# Altium schematic sheet RELAY.SchDoc
size A; SheetNumber: 5; SheetTotal: 6
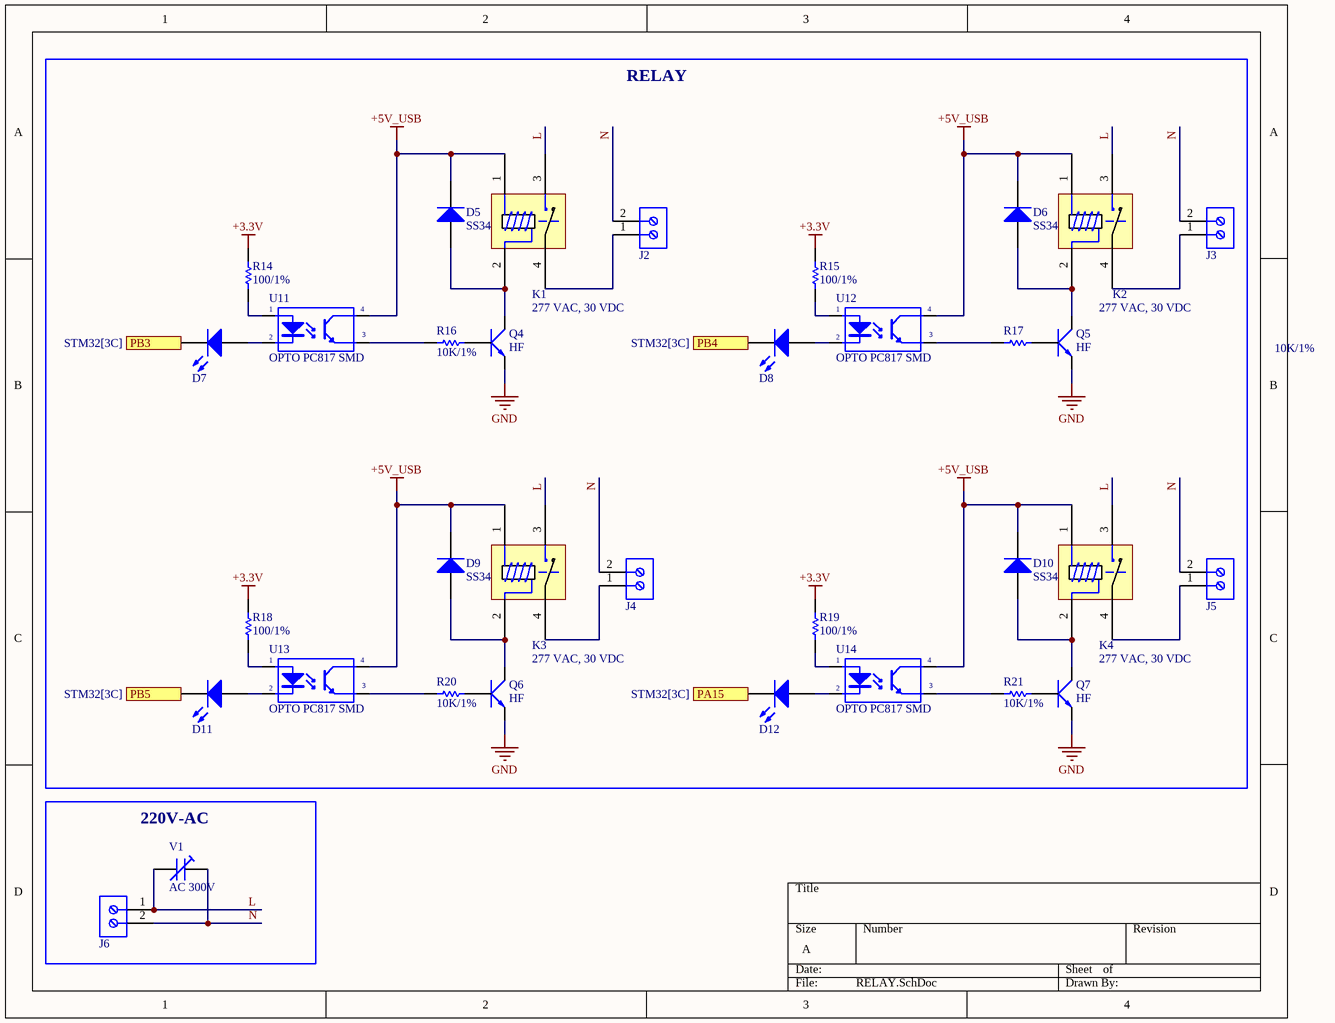
[diagram p0: RELAY.SchDoc]

## Parts
D5  SS34  [DIODE SMA]
D6  SS34  [DIODE SMA]
D7  LED SMD  [LED_0805_Blue]  (value not drawn)
D8  LED SMD  [LED_0805_Blue]  (value not drawn)
D9  SS34  [DIODE SMA]
D10  SS34  [DIODE SMA]
D11  LED SMD  [LED_0805_Blue]  (value not drawn)
D12  LED SMD  [LED_0805_Blue]  (value not drawn)
J2  10A, 300V  [691214110002]  (value not drawn)
J3  10A, 300V  [691214110002]  (value not drawn)
J4  10A, 300V  [691214110002]  (value not drawn)
J5  10A, 300V  [691214110002]  (value not drawn)
J6  10A, 300V  [691214110002]  (value not drawn)
K1  277 VAC, 30 VDC  [HF46F]
K2  277 VAC, 30 VDC  [HF46F]
K3  277 VAC, 30 VDC  [HF46F]
K4  277 VAC, 30 VDC  [HF46F]
Q4  HF  [SOT-23]
Q5  HF  [SOT-23]
Q6  HF  [SOT-23]
Q7  HF  [SOT-23]
R14  value 100/1%  [RES-SM-0805]  (hidden comment: RESISTOR SMD)
R15  value 100/1%  [RES-SM-0805]  (hidden comment: RESISTOR SMD)
R16  value 10K/1%  [RES-SM-0805]  (hidden comment: RESISTOR SMD)
R17  value 10K/1%  [RES-SM-0805]  (hidden comment: RESISTOR SMD)
R18  value 100/1%  [RES-SM-0805]  (hidden comment: RESISTOR SMD)
R19  value 100/1%  [RES-SM-0805]  (hidden comment: RESISTOR SMD)
R20  value 10K/1%  [RES-SM-0805]  (hidden comment: RESISTOR SMD)
R21  value 10K/1%  [RES-SM-0805]  (hidden comment: RESISTOR SMD)
U11  OPTO PC817 SMD  [SOP4]
U12  OPTO PC817 SMD  [SOP4]
U13  OPTO PC817 SMD  [SOP4]
U14  OPTO PC817 SMD  [SOP4]
V1  AC 300V  [Varistor]

## Blocks framed on the sheet
RELAY: D5-D12 J2-J5 K1-K4 Q4-Q7 R14-R21 U11-U14
220V-AC: J6 V1

## Ports
PA15 (in, see STM32[3C]), PB3 (in, see STM32[3C]), PB4 (in, see STM32[3C]), PB5 (in, see STM32[3C])

## Nets
+3.3V: R14.2 R15.2 R18.2 R19.2
+5V_USB: D5.2(K) D6.2(K) D9.2(K) D10.2(K) K1.1(Coil) K2.1(Coil) K3.1(Coil) K4.1(Coil) U11.4(C) U12.4(C) U13.4(C) U14.4(C)
GND: Q4.2(E) Q5.2(E) Q6.2(E) Q7.2(E)
L: J6.1 K1.3(NO) K2.3(NO) K3.3(NO) K4.3(NO) V1.1
N: J2.2 J3.2 J4.2 J5.2 J6.2 V1.2
PA15: D12.2(K) ; port PA15
PB3: D7.2(K) ; port PB3
PB4: D8.2(K) ; port PB4
PB5: D11.2(K) ; port PB5
NetD5_1: D5.1(A) K1.2(Coil) Q4.3(C)
NetD6_1: D6.1(A) K2.2(Coil) Q5.3(C)
NetD7_1: D7.1(A) U11.2(K)
NetD8_1: D8.1(A) U12.2(K)
NetD9_1: D9.1(A) K3.2(Coil) Q6.3(C)
NetD10_1: D10.1(A) K4.2(Coil) Q7.3(C)
NetD11_1: D11.1(A) U13.2(K)
NetD12_1: D12.1(A) U14.2(K)
NetJ2_1: J2.1 K1.4
NetJ3_1: J3.1 K2.4
NetJ4_1: J4.1 K3.4
NetJ5_1: J5.1 K4.4
NetQ4_1: Q4.1(B) R16.1
NetQ5_1: Q5.1(B) R17.1
NetQ6_1: Q6.1(B) R20.1
NetQ7_1: Q7.1(B) R21.1
NetR14_1: R14.1 U11.1(A)
NetR15_1: R15.1 U12.1(A)
NetR16_2: R16.2 U11.3(E)
NetR17_2: R17.2 U12.3(E)
NetR18_1: R18.1 U13.1(A)
NetR19_1: R19.1 U14.1(A)
NetR20_2: R20.2 U13.3(E)
NetR21_2: R21.2 U14.3(E)

## Library data of the parts
D5 D6 D9 D10 = Diode SS34 ( 1N5822 ): Dán; Don_Vi: Con; Ma_Hang: MH002104; Ten_Linh_Kien: Diode SS34 3A 40V SMA ( 1N5822 SS34A); Kieu_Chan: *; Chung_Loai: Dán
D7 D8 D11 D12 = LED SMD: LED
J2-J6 = 691214110002: WR-TBL Series 2141 Horizontal Entry Modular, THT, pitch 3.5mm, 2p; Manufacturer: Wurth Elektronik; Modularity: Yes; ComponentLink1Description: Website Link; ComponentLink1URL: https://www.we-online.com/redexpert/article/691214110002?ad; ComponentLink2Description: Supplier 1 URL; ComponentLink2URL: N/A; Manufacturer Part Number: 691214110002; Category: Terminal Blocks; Match Code: WR-TBL; Mount: Through Hole; Operating Temperature Max: 105°C; Operating Temperature Min: -40°C; Packaging: Box; Application: Rising Cage Clamp; Number of Pins: 2; Number of Rows: 1; Orientation: Horizontal; Pitch: 3.5mm; Rated Current: 10A; Working Voltage: 300V; ComponentLink3Description: Supplier 2 URL; ComponentLink3URL: N/A; ComponentLink4Description: Supplier 3 URL; ComponentLink4URL: https://www.thegioiic.com/kf350-2-v-domino-2-chan-thang-3-5mm-300v-10a-han-pcb; Supplier 1 Name: Mouser; Supplier 1 SN: N/A; Supplier 1 URL: N/A; Supplier 2 Name: Digi-Key; Supplier 2 SN: N/A; Supplier 2 URL: N/A; Supplier 3 Name: thegioiic; Supplier 3 SN: N/A; Supplier 3 URL: https://www.thegioiic.com/kf350-2-v-domino-2-chan-thang-3-5mm-300v-10a-han-pcb; Value: 10A, 300V
K1-K4 = HF46F-G 12-HS1: Coil Voltage: 12 VDC; Contact Current Rating: 7A; Switching Voltage Max: 277 VAC, 30 VDC; Coil Voltage: 12 VDC; Associated Relay Series: N/A; Coil Current: N/A; Coil Resistance: N/A; ComponentLink1Description: Datasheet link; ComponentLink1URL: https://source.hongfa.com//pdf/web/viewer.html?file=/Uploads/Product/PDF/HF46F-G_en.pdf?timestamp=1691116874; ComponentLink2Description: Supplier 1 URL; ComponentLink2URL: N/A; ComponentLink3Description: Supplier 2 URL; ComponentLink3URL: N/A; ComponentLink4Description: Supplier 3 URL; ComponentLink4URL: https://www.thegioiic.com/hf46f-g-12-hs1-ro-le-12vdc-7a-spst-no-4-chan; Power Consumption: N/A; Supplier 1 Name: Mouser; Supplier 1 SN: N/A; Supplier 1 URL: N/A; Supplier 2 Name: Digi-Key; Supplier 2 SN: N/A; Supplier 2 URL: N/A; Supplier 3 Name: thegioiic; Supplier 3 SN: N/A; Supplier 3 URL: https://www.thegioiic.com/hf46f-g-12-hs1-ro-le-12vdc-7a-spst-no-4-chan; Value: 277 VAC, 30 VDC
Q4-Q7 = Trans C1815 HF SMD: SOT-23; Value: C9014
R14-R21 = RESISTOR SMD: Resistor
U11-U14 = OPTO PC817 SMD: Single Opto; Value: PC817
V1 = 05000730110: Varistors 7D471K AC 300V; Manufacture  Name: Bourns; Tolerance: +/- 10%; Diameter: 7mm; Capacitance: N/A; ComponentLink1Description: Datasheet link; ComponentLink1URL: N/A; Voltage: 300V; Manufacture  SN: 7D471K; ComponentLink2Description: Supplier 1 URL; ComponentLink2URL: N/A; ComponentLink3Description: Supplier 2 URL; ComponentLink3URL: N/A; ComponentLink4Description: Supplier 3 URL; ComponentLink4URL: N/A; Supplier 1 Name: Mouser; Supplier 1 SN: N/A; Supplier 1 URL: N/A; Supplier 2 Name: Digi-Key; Supplier 2 SN: N/A; Supplier 2 URL: N/A; Supplier 3 Name: thegioiic; Supplier 3 SN: N/A; Supplier 3 URL: https://www.thegioiic.com/tu-chong-set-varistor-7d471k-300v; Value: AC 300V